# EAGLE design Relay_Card (EAGLE 6.4)

## Sheet 1 of 2
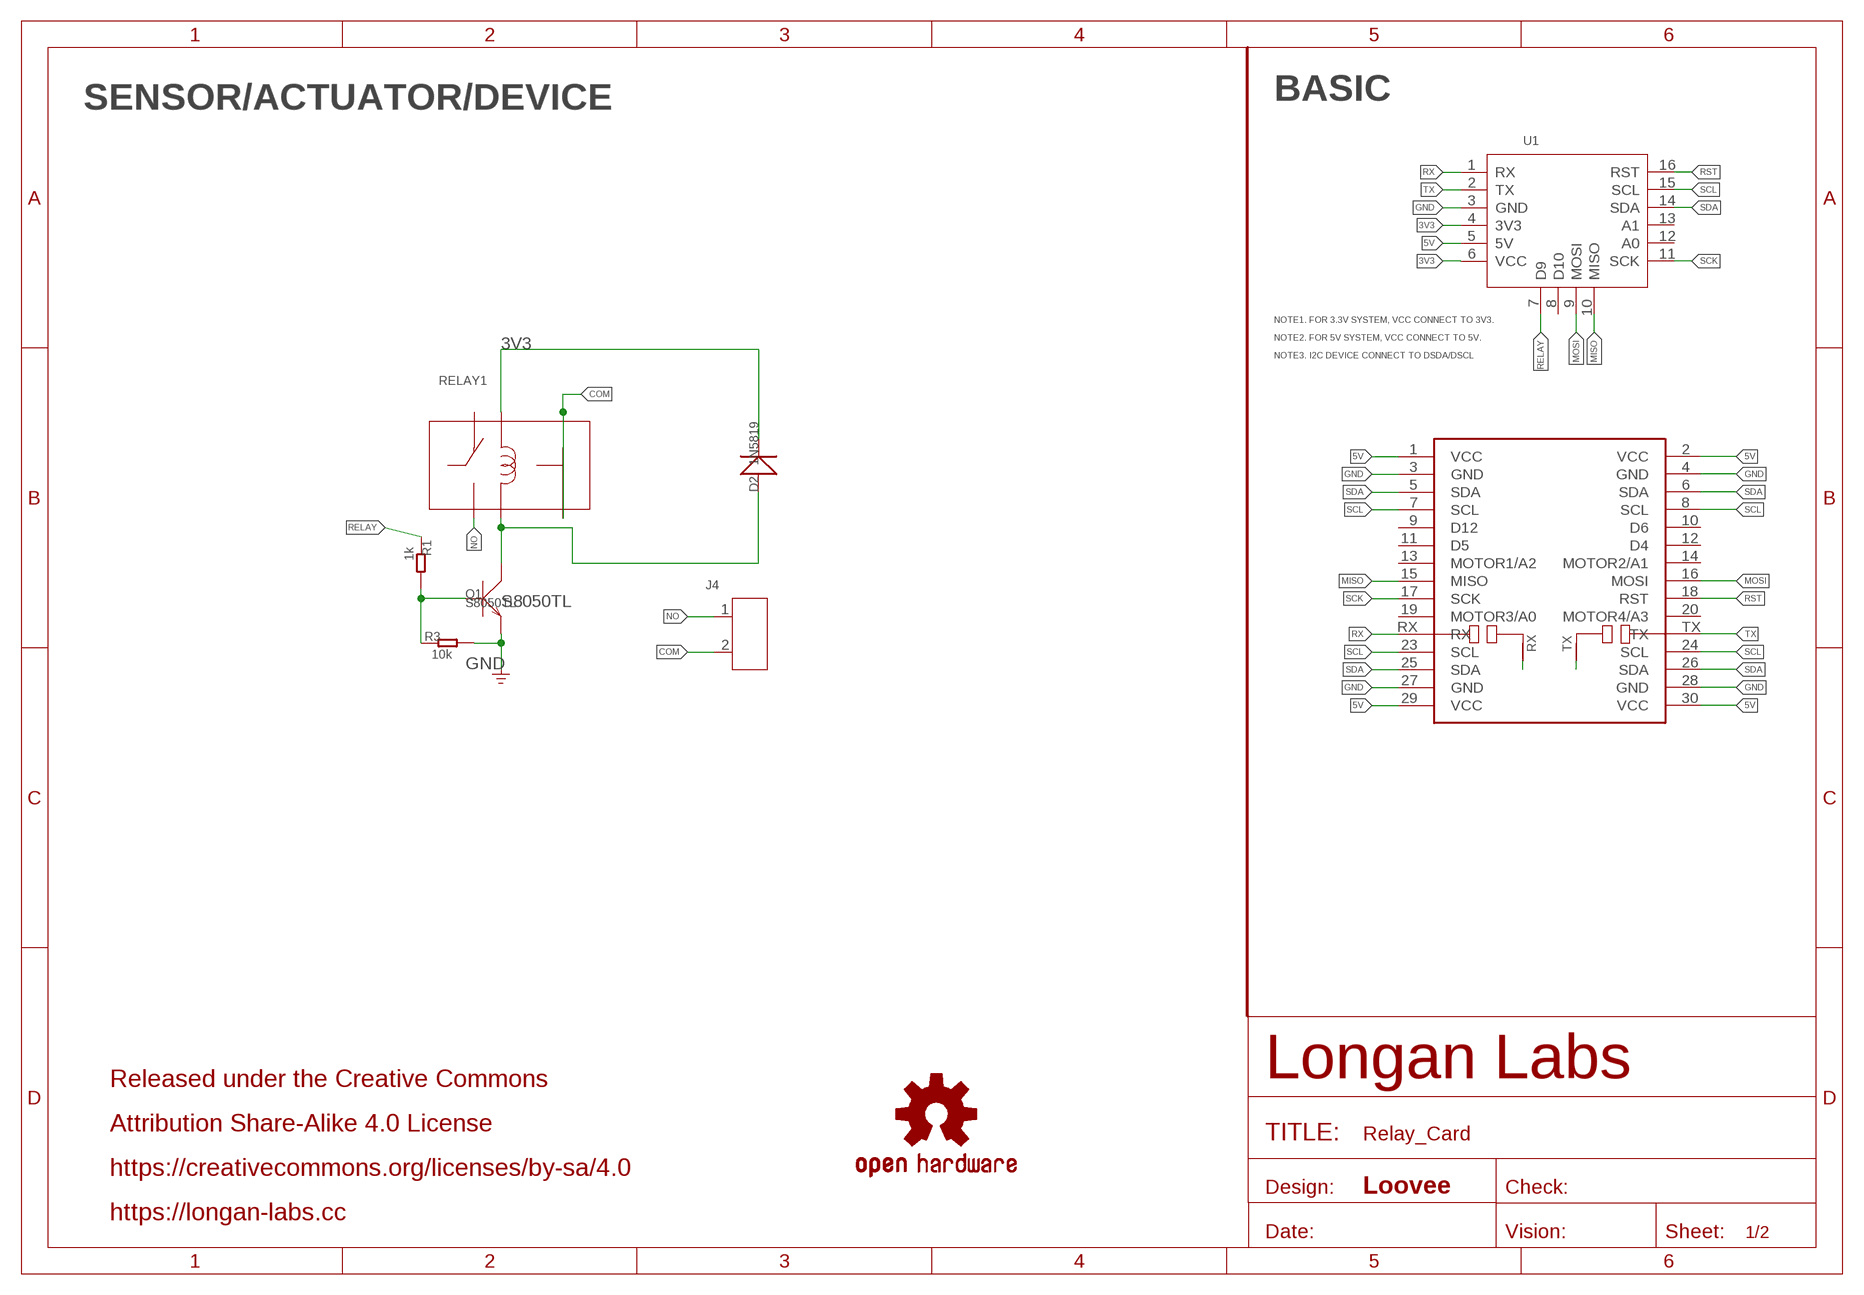
[diagram p0: schematic, sheet 1]

### Parts
D2  1N5819  D'DO-214AC'  [D2010]
J4  SCREW-TERMINAL-2P'3.5'  [H2-3.5-7.0X7.0MM]
LOGO2  OSHW-LOGOS  [OSHW-LOGO-S]
MOUDLE2  MOUDLE-CARDS-UART'BOARD'  [MOUDLE-2X15P-UART]
Q1  S8050TL  TRANSISTOR-NPN-SOT23  [SOT23]
R1  1k  R-0603  [R0603]
R3  10k  R-0603  [R0603]
RELAY1  RELAY-HK4100F  [6P-15.5X10.5X11.8MM]
U1  MOUDLE-CARDS  [16P-2.0-CARDS]

### Nets
3V3: D2.- RELAY1.2 U1.4(3V3) U1.6(VCC)
5V: MOUDLE2.1(VCC) MOUDLE2.2(VCC) MOUDLE2.29(VCC) MOUDLE2.30(VCC) U1.5(5V)
COM: J4.2 RELAY1.3 RELAY1.6
GND: MOUDLE2.3(GND) MOUDLE2.4(GND) MOUDLE2.27(GND) MOUDLE2.28(GND) Q1.2(E) R3.2 U1.3(GND) ; supply symbol labelled GND_POWER
MISO: MOUDLE2.15(MISO) U1.10(MISO)
MOSI: MOUDLE2.16(MOSI) U1.9(MOSI)
N$1: MOUDLE2.RX/N1(RX/N) MOUDLE2.RX/N2(RX/N)
N$2: MOUDLE2.TX/N1(TX/N) MOUDLE2.TX/N2(TX/N)
N$9: Q1.1(B) R1.2 R3.1
N$13: D2.+ Q1.3(C) RELAY1.5
NO: J4.1 RELAY1.4
RELAY: R1.1 U1.7(D9)
RST: MOUDLE2.18(RST) U1.16(RST)
RX: MOUDLE2.RX U1.1(RX)
SCK: MOUDLE2.17(SCK) U1.11(SCK)
SCL: MOUDLE2.7(SCL) MOUDLE2.8(SCL) MOUDLE2.23(SCL) MOUDLE2.24(SCL) U1.15(SCL)
SDA: MOUDLE2.5(SDA) MOUDLE2.6(SDA) MOUDLE2.25(SDA) MOUDLE2.26(SDA) U1.14(SDA)
TX: MOUDLE2.TX U1.2(TX)
Unconnected: MOUDLE2.9(D12) MOUDLE2.10(D6) MOUDLE2.11(D5) MOUDLE2.12(D4) MOUDLE2.13(MOTOR1/A2) MOUDLE2.14(MOTOR2/A1) MOUDLE2.19(MOTOR3/A0) MOUDLE2.20(MOTOR4/A3) RELAY1.1 U1.8(D10) U1.12(A0) U1.13(A1)

### Notes on the sheet
- SENSOR/ACTUATOR/DEVICE | BASIC
- NOTE1. FOR 3.3V SYSTEM, VCC CONNECT TO 3V3.
- NOTE2. FOR 5V SYSTEM, VCC CONNECT TO 5V.
- NOTE3. I2C DEVICE CONNECT TO DSDA/DSCL
- S8050TL
- Released under the Creative Commons
- Attribution Share-Alike 4.0 License
- https://creativecommons.org/licenses/by-sa/4.0
- Loovee
- https://longan-labs.cc

## Sheet 2 of 2

## Library data of the parts
D2 = Discrete:D*
J4 = Connector-new:SCREW-TERMINAL-2P: 2P-3.5:320110028;2P-5.0:320110031
LOGO2 = SparkFun-Aesthetics:OSHW-LOGO: Open-Source Hardware (OSHW) Logo This logo indicates the piece of hardware it is found on incorporates a OSHW license and/or adheres to the definition of open source hardware found here: http://freedomdefined.org/OSHW
MOUDLE2 = Longan-moudle:MOUDLE-CARDS-UART
Q1 = Discrete:TRANSISTOR-NPN*: NPN audion
R1 R3 = Discrete:R*
RELAY1 = LONGAN-DISCRETE:RELAY-HK4100F
U1 = MOUDLE-CARDS:MOUDLE-CARDS

## Net classes
0 default: width 0.152 mm, clearance 0.152 mm

## Board
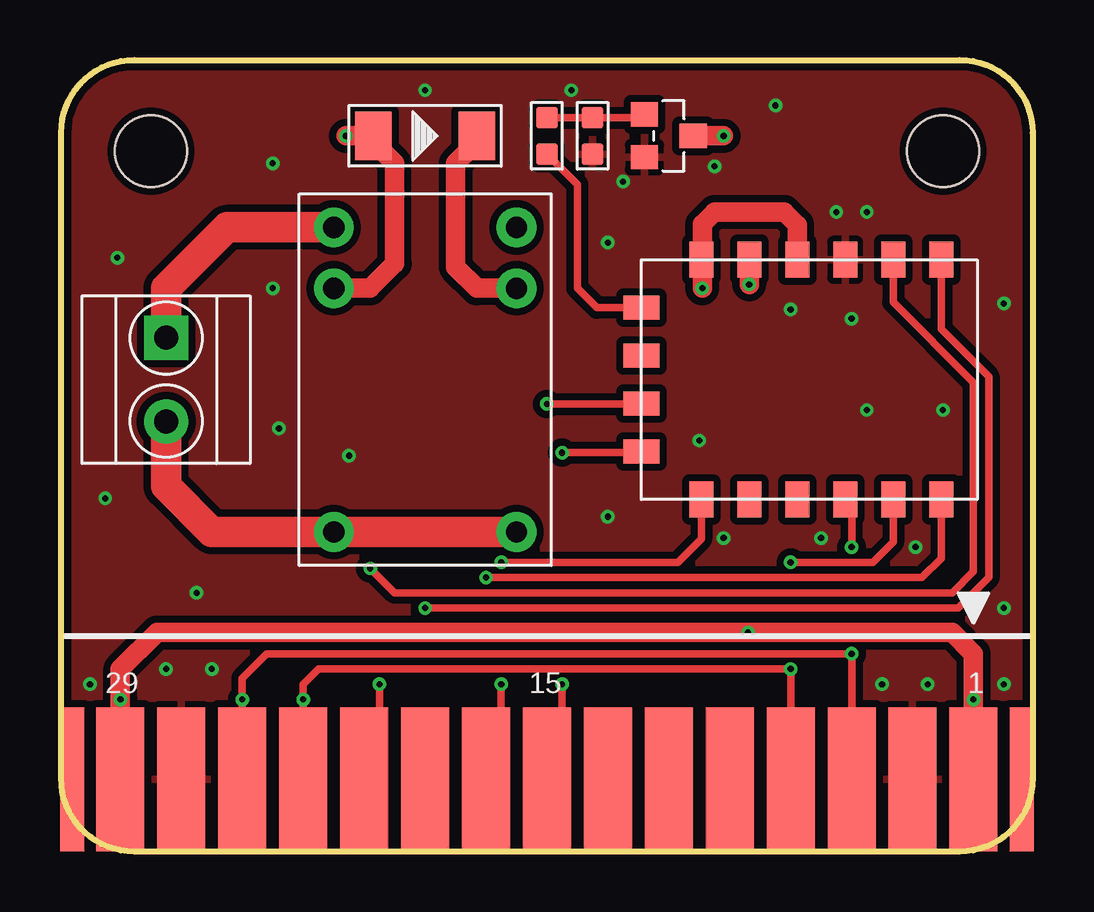
[diagram p1: board, top side]
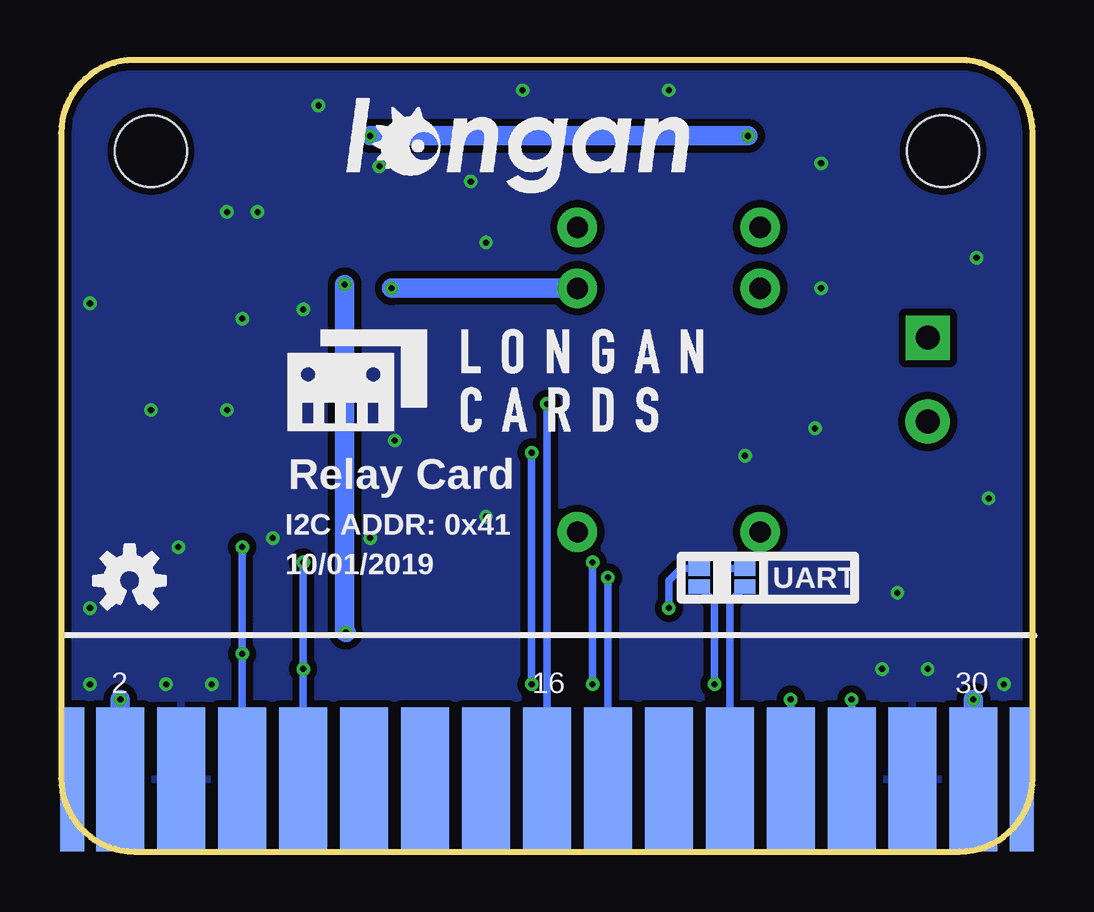
[diagram p2: board, bottom side, seen from below]

Size 40.5 x 33 mm. Coordinates in mm from the lower left corner, seen from the top.
Copper layers (1*16): Top 0.035mm / dielectric 1.5mm / Bottom 0.035mm
Design rules "SeeedStudio_2layer_DRU_no_angle_20140221 *": minimum track width 6mil, minimum drill 10mil, track to track 6mil, track to pad 6mil, pad to pad 6mil, via to via 6mil, smd to smd 0mil, copper to edge 10mil, drill to drill 10mil, minimum pad ring 10mil, minimum via ring 6mil, stop-mask expansion 2mil, vias tented up to drill 25mil, thermal gap 10mil

### Footprints (pad centres in the part's own frame; a part is rotated, then mirrored left to right if it is on the bottom)
D2010 = smd 1.524 x 2.032: + -2.159,0; - 2.159,0
H2-3.5-7.0X7.0MM = drill 1 pad 1.85 square: 1 -1.75,0 | drill 1 pad 1.85: 2 1.75,0
MOUDLE-2X15P-UART = smd 2 x 6: 1 17.78,-13.492; 3 15.24,-13.492; 5 12.7,-13.492; 7 10.16,-13.492; 9 7.62,-13.492; 11 5.08,-13.492; 13 2.54,-13.492; 15 0,-13.492; 17 -2.54,-13.492; 19 -5.08,-13.492; 23 -10.16,-13.492; 25 -12.7,-13.492; 27 -15.24,-13.492; 29 -17.78,-13.492; RX/N2 -7.62,-13.492 | smd 2 x 6 bottom: 2 17.78,-13.492; 4 15.24,-13.492; 6 12.7,-13.492; 8 10.16,-13.492; 10 7.62,-13.492; 12 5.08,-13.492; 14 2.54,-13.492; 16 0,-13.492; 18 -2.54,-13.492; 20 -5.08,-13.492; 24 -10.16,-13.492; 26 -12.7,-13.492; 28 -15.24,-13.492; 30 -17.78,-13.492; TX/N2 -7.62,-13.492 | smd 1 x 6: P1 -19.8,-13.492; P4 19.8,-13.492 | smd 1 x 6 bottom: P2 -19.8,-13.492; P3 19.8,-13.492 | smd 0.889 x 0.61 bottom: RX -6.35,-4.699; RX/N1 -6.35,-5.461; TX -8.255,-4.699; TX/N1 -8.255,-5.461 | hole 3: -16.51,12.7; 16.51,12.7
SOT23 = smd 1.016 x 1.143: 1 -0.889,-1.016; 2 0.889,-1.016; 3 0,1.016
R0603 = smd 0.889 x 0.889: 1 -0.762,0; 2 0.762,0
6P-15.5X10.5X11.8MM = drill 0.889 pad 1.651: 1 -6.35,3.81; 2 -3.81,3.81; 3 6.35,3.81; 4 -6.35,-3.81; 5 -3.81,-3.81; 6 6.35,-3.81
16P-2.0-CARDS = smd 1.5 x 1: 1 -5,5; 2 -5,3; 3 -5,1; 4 -5,-1; 5 -5,-3; 6 -5,-5; 11 5,-5; 12 5,-3; 13 5,-1; 14 5,1; 15 5,3; 16 5,5 | smd 1 x 1.5: 7 -3,-7.5; 8 -1,-7.5; 9 1,-7.5; 10 3,-7.5

### Placement (x,y rotation side)
D2  15.17,29.84 0 top
J4  4.38,19.68 270 top
LOGO2  37.65,11.29 0 bottom
MOUDLE2  20.25,16.5 0 top
Q1  25.33,29.84 270 top
R1  20.25,29.84 90 top
R3  22.16,29.84 270 top
RELAY1  15.17,19.68 270 top
U1  31.68,19.68 270 top
U$1  [LONGAN-CARDS-MIDDLE]  31.81,17.01 0 bottom
U$2  [LONGAN-SILK-SMALLER]  29.9,26.28 0 bottom

### Tracks (layer width: path | path; a pad name or v marks a point on that pad's centre or on a via)
3V3  (via drill 0.25 pad 0.51)
  Top 0.152: U1.6 26.68,25.34
  Top 0.813: RELAY1.2 17.33,23.48 16.44,24.37 16.44,28.69 17.33,29.58 D2.- | 26.6,24.59 U1.6 26.73,24.63 | v26.73,23.48 26.73,24.63 | 26.73,24.63 26.73,26.15 27.23,26.66 30.14,26.66 30.68,26.12 U1.4
  Bottom 0.813: RELAY1.2 v26.73,23.48
5V  (via drill 0.25 pad 0.51)
  Top 0.508: 38.03,6.47 v38.03,6.34
  Top 0.813: U1.5 v28.68,23.64 | MOUDLE2.30 v2.47,6.34 2.47,7.61 3.99,9.13 v28.63,9.13 37.14,9.13 38.03,8.24 38.03,6.47 MOUDLE2.2
  Bottom 0.813: v28.68,23.64 28.68,9.18 v28.63,9.13 | v2.47,6.34 MOUDLE2.30 | v38.03,6.34 MOUDLE2.2
COM
  Top 1.27: RELAY1.3 RELAY1.6 6.28,13.32 4.38,15.23 J4.2
GND  (via drill 0.25 pad 0.51)
  other vias: 34.22,6.97 36.12,6.97 39.3,6.97 1.2,6.97 23.43,27.93 36.76,18.41 30.41,22.6 26.6,17.14 32.95,22.21 33.59,18.41 33.59,26.66 27.23,28.56 22.79,25.39 4.38,7.61 6.28,7.61 11.99,16.5 5.64,10.79 22.79,13.96 35.62,12.69 31.68,13.07 27.62,13.07 39.3,10.15 15.17,31.74 21.27,31.74 32.31,26.66 39.3,22.85 8.82,28.69 8.82,23.48 29.77,31.11 9.07,17.64 1.84,14.72 2.34,24.76
  pour Top (isolate 0.305): -0.07,33.01 40.57,33.01 40.57,-0.01 -0.07,-0.01
  pour Bottom (isolate 0.305): -0.07,33.01 40.57,33.01 40.57,-0.01 -0.07,-0.01
MISO  (via drill 0.25 pad 0.51)
  Top 0.305: v20.89,6.97 20.89,5.71 20.25,5.07 MOUDLE2.15 | v20.89,16.63 24.13,16.63 U1.10
  Bottom 0.305: v20.89,6.97 v20.89,16.63
MOSI  (via drill 0.25 pad 0.51)
  Top 0.305: v20.25,18.66 24.16,18.66 U1.9
  Bottom 0.305: v20.25,18.66 MOUDLE2.16
N$1  (via drill 0.25 pad 0.51)
  Top 0.305: MOUDLE2.RX/N2 12.63,4.44 13.27,5.07 v13.27,6.97
  Bottom 0.305: v13.27,6.97 13.27,10.4 MOUDLE2.RX/N1
N$2
  Bottom 0.305: MOUDLE2.TX/N2 12.63,10.4 MOUDLE2.TX/N1
N$9
  Top 0.305: R1.2 R3.1 24.19,30.6 Q1.1
N$13  (via drill 0.25 pad 0.51)
  Top 0.813: RELAY1.5 12.88,23.48 13.9,24.5 13.9,28.69 13.01,29.58 D2.+ v11.87,29.84 | Q1.3 v27.62,29.84
  Bottom 0.813: v27.62,29.84 v11.87,29.84
NO
  Top 1.27: RELAY1.4 6.91,26.02 4.38,23.48 J4.1
RELAY
  Top 0.305: U1.7 22.33,22.68 21.52,23.48 21.52,27.8 R1.1
RST  (via drill 0.25 pad 0.51)
  Top 0.305: U1.16 36.68,12.23 35.87,11.42 v17.71,11.42
  Bottom 0.305: v17.71,11.42 MOUDLE2.18
RX  (via drill 0.25 pad 0.51)
  Top 0.305: U1.1 36.68,21.79 38.66,19.8 38.66,11.42 37.39,10.15 v15.17,10.15
  Bottom 0.305: v15.17,10.15 15.17,11.29 14.66,11.8 MOUDLE2.RX
SCK  (via drill 0.25 pad 0.51)
  Top 0.305: v18.34,6.97 18.34,3.64 MOUDLE2.17 | v18.34,12.05 25.71,12.05 26.68,13.02 U1.11
  Bottom 0.305: v18.34,6.97 v18.34,12.05
SCL  (via drill 0.25 pad 0.51)
  Top 0.305: U1.15 34.68,12.9 33.84,12.05 v30.41,12.05 | MOUDLE2.23 v10.09,6.34 10.09,6.97 10.72,7.61 v30.41,7.61 MOUDLE2.8
  Bottom 0.305: v30.41,12.05 v30.41,7.61 MOUDLE2.8 | v10.09,6.34 MOUDLE2.23
SDA  (via drill 0.25 pad 0.51)
  Top 0.305: v32.95,12.69 32.95,14.4 U1.14 | MOUDLE2.25 v7.55,6.34 7.55,7.23 8.57,8.24 v32.95,8.24 MOUDLE2.6
  Bottom 0.305: v32.95,12.69 32.95,9.64 v32.95,8.24 MOUDLE2.6 | v7.55,6.34 MOUDLE2.25
TX  (via drill 0.25 pad 0.51)
  Top 0.305: U1.2 34.68,22.9 38.03,19.55 38.03,11.67 37.14,10.79 13.9,10.79 v12.88,11.8
  Bottom 0.305: v12.88,11.8 MOUDLE2.TX

### Text on the board
bPlace: Relay Card | I2C ADDR: 0x41 | 10/01/2019